# EAGLE schematic ir_shield (EAGLE 7.1.0)
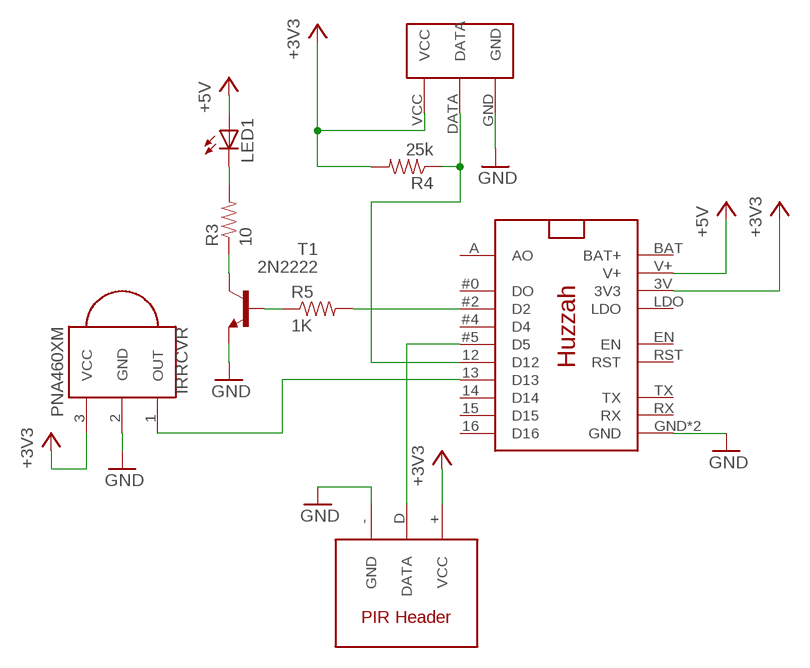
[diagram p0: schematic, sheet 1]

## Parts
IRRCVR  PNA460XM  [PNA460XM]
LED1  LEDIRL80A  [IRL80A]
R3  10  RESISTOR0402-RES  [0402-RES]
R4  25k  RESISTOR0402-RES  [0402-RES]
R5  1K  RESISTOR0402-RES  [0402-RES]
T1  2N2222  [TO92-EBC-OVAL]
U$1  HUZZAH_SHIELDOUTSIDE  [HUZZAH_OUTSIDE]
U$3  DHT11VERT  [DHT11-VERT]
U$4  PIR  [3_PIN_HEADER]

## Nets
+3V3: IRRCVR.3(VCC) R4.2 U$1.3V(3V3) U$3.VCC U$4.+(VCC)
+5V: LED1.A U$1.V+
GND: IRRCVR.2(GND) T1.E U$1.GND U$1.GND2(GND) U$3.GND U$4.-(GND)
N$1: LED1.K(C) R3.2
N$2: R3.1 T1.C
N$3: R5.1 T1.B
N$4: R5.2 U$1.#2(D2)
N$5: IRRCVR.1(OUT) U$1.13(D13)
N$6: R4.1 U$1.12(D12) U$3.DATA
N$7: U$1.#5(D5) U$4.D(DATA)
Unconnected: U$1.14(D14) U$1.15(D15) U$1.16(D16) U$1.#0(DO) U$1.#4(D4) U$1.A(AO) U$1.BAT(BAT+) U$1.EN U$1.LDO U$1.RST U$1.RX U$1.TX

## Library data of the parts
IRRCVR = adafruit:PNA460XM: IR 38KHz receiver PNA4602 and related receivers http://www.ladyada.net/library/pcb/eaglelibrary.html
LED1 = adafruit:LED: LED OSRAM: - CHIPLED LG R971, LG N971, LY N971, LG Q971, LY Q971, LO R971, LY R971 LH N974, LH R974 LS Q976, LO Q976, LY Q976 LO Q996 - Hyper CHIPLED LW Q18S LB Q993, LB Q99A, LB R99A - SideLED LS A670, LO A670, LY A670, LG A670, LP A670 LB A673, LV A673, LT A673, LW A673 LH A674 LY A675 LS A676, LA A676, LO A676, LY A676, LW A676 LS A679, LY A679, LG A679 - Hyper Micro SIDELED® LS Y876, LA Y876, LO Y876, LY Y876 LT Y87S - SmartLED LW L88C, LW L88S LB L89C, LB L89S, LG L890 LS L89K, LO L89K, LY L89K LS L896, LA L896, LO L896, LY L896 - TOPLED LS T670, LO T670, LY T670, LG T670, LP T670 LSG T670, LSP T670, LSY T670, LOP T670, LYG T670 LG T671, LOG T671, LSG T671 LB T673, LV T673, LT T673, LW T673 LH T674 LS T676, LA T676, LO T676, LY T676, LB T676, LH T676, LSB T676, LW T676 LB T67C, LV T67C, LT T67C, LS T67K, LO T67K, LY T67K, LW E67C LS E67B, LA E67B, LO E67B, LY E67B, LB E67C, LV E67C, LT E67C LW T67C LS T679, LY T679, LG T679 LS T770, LO T770, LY T770, LG T770, LP T770 LB T773, LV T773, LT T773, LW T773 LH T774 LS E675, LA E675, LY E675, LS T675 LS T776, LA T776, LO T776, LY T776, LB T776 LHGB T686 LT T68C, LB T68C - Hyper Mini TOPLED® LB M676 - Mini TOPLED Santana® LG M470 LS M47K, LO M47K, LY M47K Source: http://www.osram.convergy.de/
R3-R5 = SparkFun-Passives:RESISTOR: Resistor Basic schematic elements and footprints for 0603, 1206, and PTH resistors.
T1 = adafruit:2N2222: NPN TRANSISTOR Big oval pads
U$1 = DZ:HUZZAH_SHIELD
U$3 = DZ:DHT11
U$4 = DZ:PIR